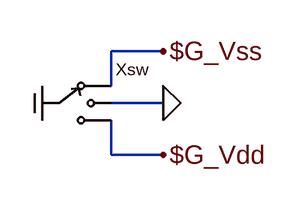
[diagram p0: schematic sp3t-trit.asc]
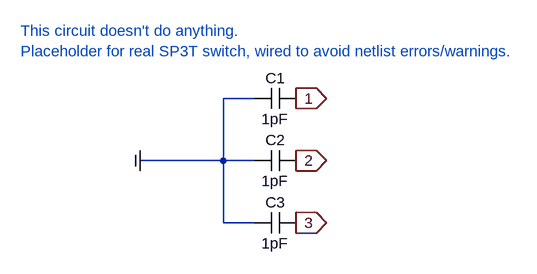
[diagram p1: sub-circuit sp3t.asc]
sp3t-trit.asc, the LTspice schematic file:
Version 4
SHEET 1 880 680
WIRE 224 96 176 96
WIRE 176 128 176 96
WIRE 224 144 176 144
WIRE 176 192 176 160
WIRE 224 192 176 192
FLAG 112 144 COM
IOPIN 112 144 In
FLAG 224 96 $G_Vss
FLAG 224 144 0
FLAG 224 192 $G_Vdd
SYMBOL sp3t 176 144 R0
SYMATTR InstName Xsw

sp3t.asc, the sub-circuit schematic file:
Version 4
SHEET 1 880 680
WIRE 176 64 128 64
WIRE 128 160 128 64
WIRE 128 160 0 160
WIRE 176 160 128 160
WIRE 128 256 128 160
WIRE 176 256 128 256
FLAG 0 160 COM
IOPIN 0 160 In
FLAG 240 64 1
IOPIN 240 64 Out
FLAG 240 160 2
IOPIN 240 160 Out
FLAG 240 256 3
IOPIN 240 256 Out
SYMBOL cap 240 48 R90
WINDOW 0 0 32 VBottom 0
WINDOW 3 32 32 VTop 0
SYMATTR InstName C1
SYMATTR Value 1pF
SYMBOL cap 176 144 M90
WINDOW 0 0 32 VBottom 0
WINDOW 3 32 32 VTop 0
SYMATTR InstName C2
SYMATTR Value 1pF
SYMBOL cap 176 240 M90
WINDOW 0 0 32 VBottom 0
WINDOW 3 32 32 VTop 0
SYMATTR InstName C3
SYMATTR Value 1pF
TEXT -184 -40 Left 0 ;This circuit doesn't do anything.\nPlaceholder for real SP3T switch, wired to avoid netlist errors/warnings.

The netlist it stands for:
* sp3t-trit.asc
XXsw $G_Vss 0 $G_Vdd COM sp3t

* block symbol definitions
.subckt sp3t 1 2 3 COM
C1 1 COM 1pF
C2 COM 2 1pF
C3 COM 3 1pF
* This circuit doesn't do anything.
* Placeholder for real SP3T switch, wired to avoid netlist errors/warnings.
.ends sp3t

.backanno
.end